# Altium schematic sheet STEERING_WHEEL_SWITCHES_V2_SWITCH_BOARD.SchDoc
size C; SheetNumber: 1; SheetTotal: 1
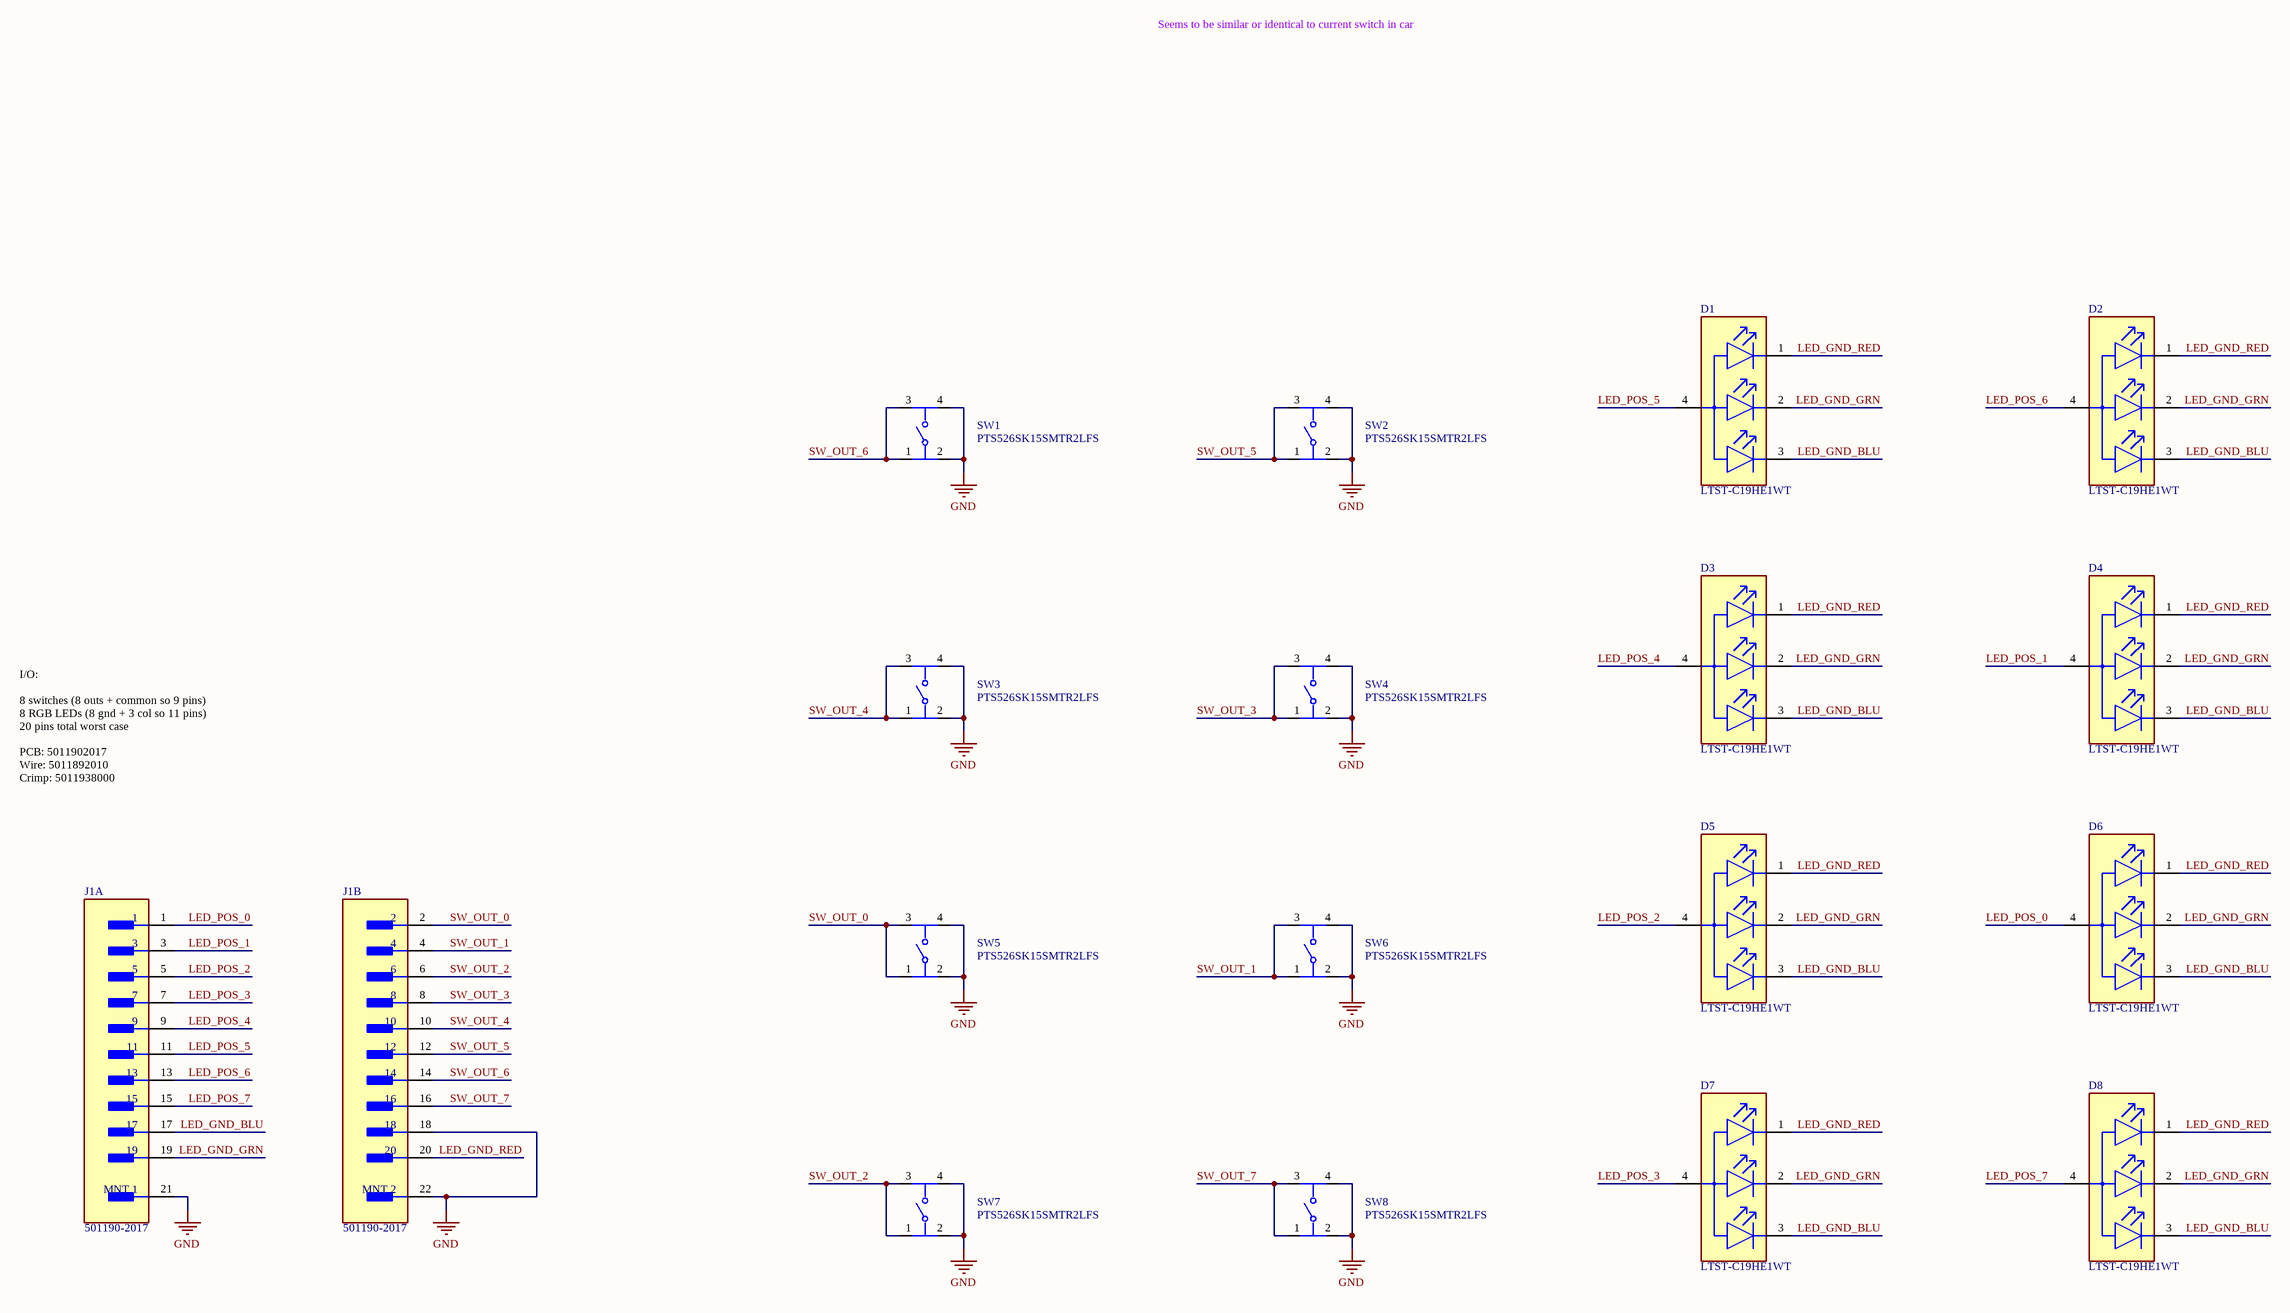
[diagram p0: STEERING_WHEEL_SWITCHES_V2_SWITCH_BOARD.SchDoc]

## Parts
D1  LTST-C19HE1WT  [FP-LTST-C19HE1WT-MFG]
D2  LTST-C19HE1WT  [FP-LTST-C19HE1WT-MFG]
D3  LTST-C19HE1WT  [FP-LTST-C19HE1WT-MFG]
D4  LTST-C19HE1WT  [FP-LTST-C19HE1WT-MFG]
D5  LTST-C19HE1WT  [FP-LTST-C19HE1WT-MFG]
D6  LTST-C19HE1WT  [FP-LTST-C19HE1WT-MFG]
D7  LTST-C19HE1WT  [FP-LTST-C19HE1WT-MFG]
D8  LTST-C19HE1WT  [FP-LTST-C19HE1WT-MFG]
J1  501190-2017  [FP-501190-2017-MFG]  (parts A,B of 2)
SW1  PTS526SK15SMTR2LFS  [FP-PTS526SK15SMTR2LFS-MFG]
SW2  PTS526SK15SMTR2LFS  [FP-PTS526SK15SMTR2LFS-MFG]
SW3  PTS526SK15SMTR2LFS  [FP-PTS526SK15SMTR2LFS-MFG]
SW4  PTS526SK15SMTR2LFS  [FP-PTS526SK15SMTR2LFS-MFG]
SW5  PTS526SK15SMTR2LFS  [FP-PTS526SK15SMTR2LFS-MFG]
SW6  PTS526SK15SMTR2LFS  [FP-PTS526SK15SMTR2LFS-MFG]
SW7  PTS526SK15SMTR2LFS  [FP-PTS526SK15SMTR2LFS-MFG]
SW8  PTS526SK15SMTR2LFS  [FP-PTS526SK15SMTR2LFS-MFG]

## Nets
GND: J1.18 J1.21(MNT_1) J1.22(MNT_2) SW1.2 SW1.4 SW2.2 SW2.4 SW3.2 SW3.4 SW4.2 SW4.4 SW5.2 SW5.4 SW6.2 SW6.4 SW7.2 SW7.4 SW8.2 SW8.4
LED_GND_BLU: D1.3(BLUE_C) D2.3(BLUE_C) D3.3(BLUE_C) D4.3(BLUE_C) D5.3(BLUE_C) D6.3(BLUE_C) D7.3(BLUE_C) D8.3(BLUE_C) J1.17
LED_GND_GRN: D1.2(GREEN_C) D2.2(GREEN_C) D3.2(GREEN_C) D4.2(GREEN_C) D5.2(GREEN_C) D6.2(GREEN_C) D7.2(GREEN_C) D8.2(GREEN_C) J1.19
LED_GND_RED: D1.1(RED_C) D2.1(RED_C) D3.1(RED_C) D4.1(RED_C) D5.1(RED_C) D6.1(RED_C) D7.1(RED_C) D8.1(RED_C) J1.20
LED_POS_0: D6.4(A) J1.1
LED_POS_1: D4.4(A) J1.3
LED_POS_2: D5.4(A) J1.5
LED_POS_3: D7.4(A) J1.7
LED_POS_4: D3.4(A) J1.9
LED_POS_5: D1.4(A) J1.11
LED_POS_6: D2.4(A) J1.13
LED_POS_7: D8.4(A) J1.15
SW_OUT_0: J1.2 SW5.1 SW5.3
SW_OUT_1: J1.4 SW6.1 SW6.3
SW_OUT_2: J1.6 SW7.1 SW7.3
SW_OUT_3: J1.8 SW4.1 SW4.3
SW_OUT_4: J1.10 SW3.1 SW3.3
SW_OUT_5: J1.12 SW2.1 SW2.3
SW_OUT_6: J1.14 SW1.1 SW1.3
SW_OUT_7: J1.16 SW8.1 SW8.3

## Notes on the sheet
- Seems to be similar or identical to current switch in car
- I/O:
  8 switches (8 outs + common so 9 pins)
  8 RGB LEDs (8 gnd + 3 col so 11 pins)
  20 pins total worst case
  PCB: 5011902017
  Wire: 5011892010
  Crimp: 5011938000

## Library data of the parts
D1-D8 = CMP-2000-05201-2: LED RGB DIFFUSED CHIP SMD; Number of LEDs: 3; Test Current: 20mA; Luminous Intensity: 180mcd; Lens Color: White; Dominant Wavelength: 470nm; Color: Blue; Reverse Voltage: 5V; Viewing Angle: 130°; Forward Voltage: 3.35V; Max Operating Temperature: 80°C; Packaging: Tape and Reel; Lens Transparency: Diffused; Width: 1.6mm; Case Code (Metric): 1616; Height: 0.35mm; Lens Style: Diffused; Mount: Surface Mount; Package Quantity: 3000; Radiation Hardening: No; Length: 1.6mm; Case/Package: 0606; Forward Current: 20mA; Case Code (Imperial): 0606; Lead Free: Lead Free; Min Operating Temperature: -20°C; Number of Elements: 3; Number of Pins: 4; Depth: 1.6mm
J1 = CMP-04776-000294-1: CONN HEADER SMD 20POS 1MM; Contact Resistance: 20mR; Number of Contacts: 20; Voltage Rating: 50V; Connector Type: Male Pin; Current Rating: 1A; Glow Wire Compliant: Non-compliant; Row Spacing: 0.105inch; Gender: Male; Termination: Solder; Housing Color: Natural; Package Quantity: 1100; Contact Type: Male Pin; Number of Circuits: 20; Min Operating Temperature: -40°C; Mount: Surface Mount; Length: 12.3mm; Pitch: 1mm; Housing Material: Thermoplastic; Depth: 7.27mm; Orientation: Vertical; Max Operating Temperature: 85°C; Lead Free: Lead Free; Voltage Rating (DC): 50V; Series: Pico-Clasp; Number of Rows: 2; Contact Material: Bronze; Contact Plating: Gold; Color: Natural; Radiation Hardening: No; Fastening Type: Latch; Packaging: Tape and Reel; Number of Positions: 20
SW1-SW8 = CMP-10040-000013-1: TACT 5.2 X 5.2, 1.5 MM H, 260GF,; Manufacturer: C&K; Operating Force: 250gf; Throw Configuration: SPST-NO; Contact Current Rating: 50mA; Standoff Height: 0mm; Contact Resistance: 100mΩ; Voltage Rating Dc: 12V; Electromechanical Life: 200000Cycles; Device Class L3: Tactile Switches; Device Class L2: Switches; Temperature: -20°C to +70°C; Temperature Range Low: -20°C; Package: PTS526SK15SMTR2LFS; Temperature Range High: +70°C; ComponentLink2Description: Datasheet; Device Class L1: Electromechanical; Height: 1.65mm; Digikey Description: TACT 5.2 X 5.2, 1.5 MM H, 260GF,; Category: Switch; RoHS: TRUE; Automotive: No; Lead Free: Yes; Manufacturer Part Number: PTS526SK15SMTR2LFS; Octopart: https://octopart.com/pts526+sk15+smtr2+lfs-c%26k+components-100617999; ComponentLink2URL: https://www.ckswitches.com/media/2780/pts526.pdf